# EAGLE design powerled (EAGLE 6.4)
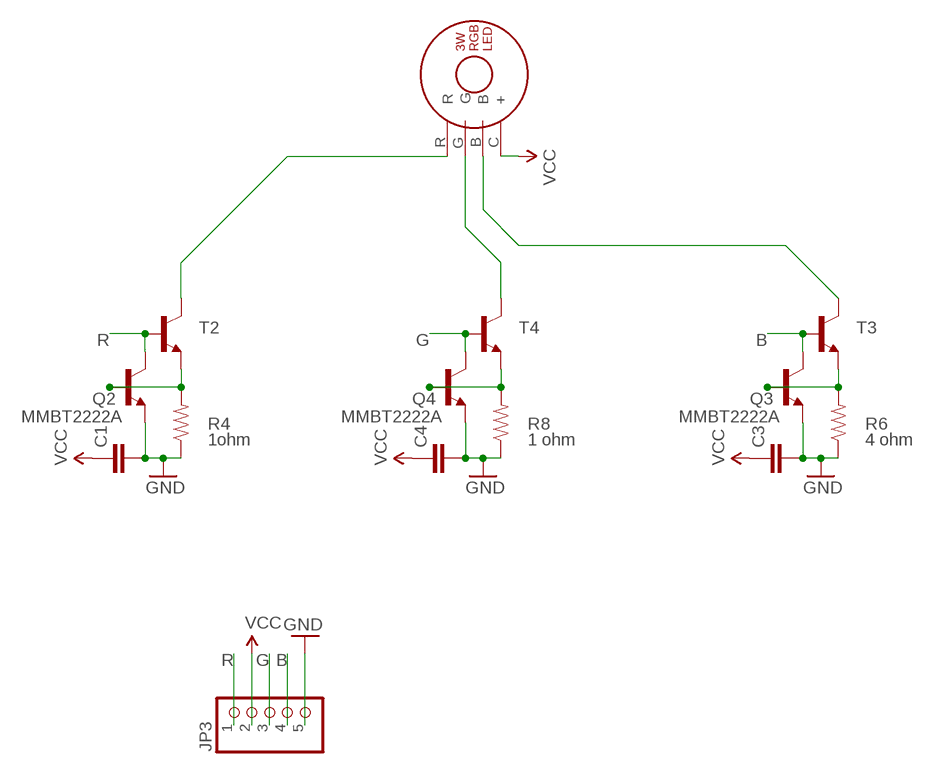
[diagram p0: schematic, sheet 1]

## Parts
C1  SPARKFUN_CAP0603-CAP  [SPARKFUN_0603-CAP]
C3  SPARKFUN_CAP0603-CAP  [SPARKFUN_0603-CAP]
C4  SPARKFUN_CAP0603-CAP  [SPARKFUN_0603-CAP]
JP3  PINHD-1X5  [1X05]
Q2  MMBT2222A  TRANSISTOR_NPNMMBT2222A  [SOT23-3]
Q3  MMBT2222A  TRANSISTOR_NPNMMBT2222A  [SOT23-3]
Q4  MMBT2222A  TRANSISTOR_NPNMMBT2222A  [SOT23-3]
R4  1ohm  RESISTOR0603-RES  [0603-RES]
R6  4 ohm  RESISTOR0603-RES  [0603-RES]
R8  1 ohm  RESISTOR0603-RES  [0603-RES]
T2  BCX54-NPN-SOT89-BCE  [SOT89-BCE]
T3  BCX54-NPN-SOT89-BCE  [SOT89-BCE]
T4  BCX54-NPN-SOT89-BCE  [SOT89-BCE]
U$1  RGB3W  [RGB3W]

## Nets
B: JP3.4 Q3.3(C) T3.B
G: JP3.3 Q4.3(C) T4.B
GND: C1.2 C3.2 C4.2 JP3.5 Q2.2(E) Q3.2(E) Q4.2(E) R4.1 R6.1 R8.1
N$1: T2.C U$1.R
N$2: T4.C U$1.G
N$3: T3.C U$1.B
N$8: Q2.1(B) R4.2 T2.E
N$11: Q3.1(B) R6.2 T3.E
N$13: Q4.1(B) R8.2 T4.E
R: JP3.1 Q2.3(C) T2.B
VCC: C1.1 C3.1 C4.1 JP3.2 U$1.C(+)

## Library data of the parts
C1 C3 C4 = MS3000_V1:SPARKFUN_CAP: Capacitor Standard 0603 ceramic capacitor, and 0.1" leaded capacitor.
JP3 = pinhead:PINHD-1X5: PIN HEADER
Q2-Q4 = SparkFun-DiscreteSemi:TRANSISTOR_NPN: Generic NPN BJT MMBT2222A - TRANS-08049 (SOT-23, 1A 40V) MPSA42 - TRANS-09116 (SOT-23, 500mA 300V) MMBT5088LT1G - TRANS-11160 (SOT-23, 50 mA 30V) BC547 - COM-08928 <http://www.sparkfun.com/products/8928> (TO-92 45V 100mA) (1.Collector 2.Base 3.Emitter) 2N3904 - COM-00521 <http://www.sparkfun.com/products/521> (TO-92 40V 200mA) (1.Emitter 2.Base 3.Collector) P2N2222A - COM-12852 <http://www.sparkfun.com/products/12852> (TO-92 40V 600mA) (1.Collector 2.Base 3.Emitter); PROD_ID: TRANS-08049
R4 R6 R8 = SparkFun-Passives:RESISTOR: Resistor Basic schematic elements and footprints for 0603, 1206, and PTH resistors.
T2-T4 = transistor:*-NPN-: NPN Transistror BF959 corrected 2008.03.06
U$1 = poerledlib:RGB3W

## Board
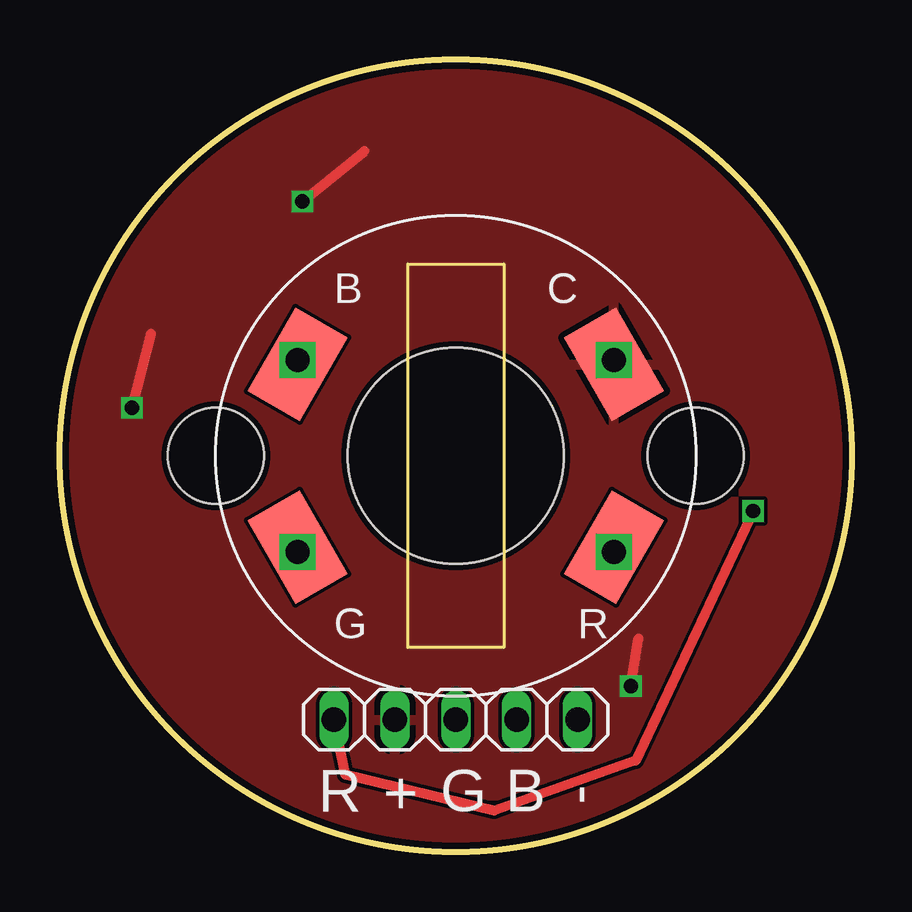
[diagram p1: board, top side]
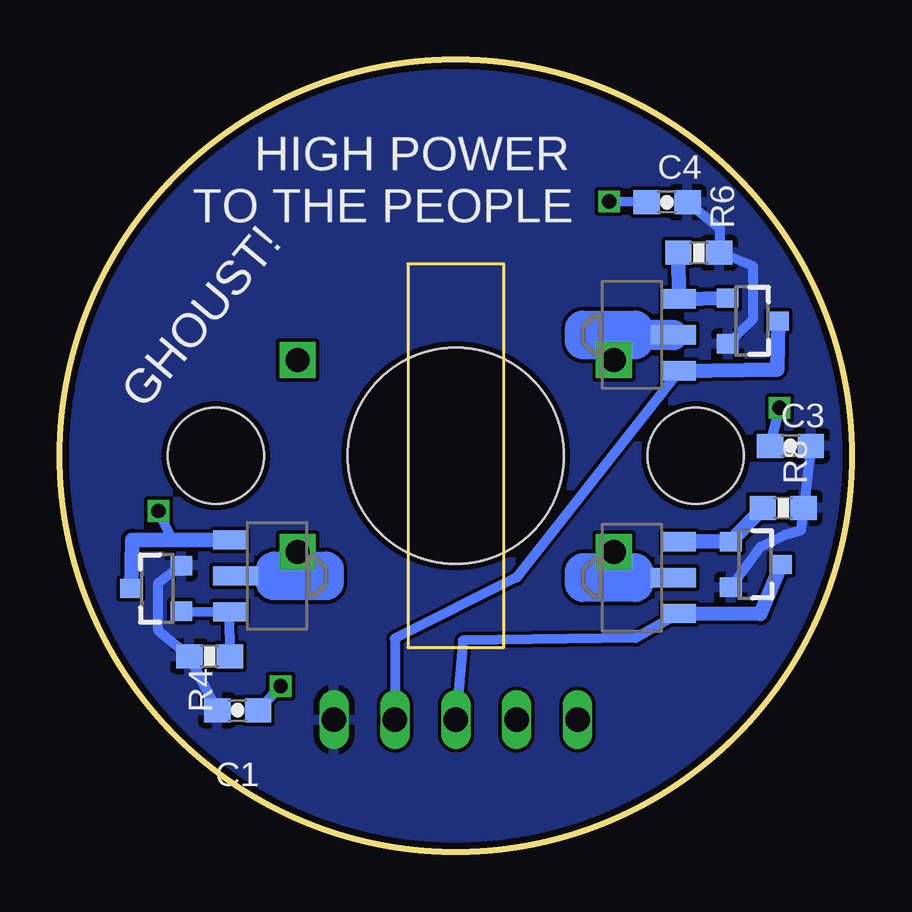
[diagram p2: board, bottom side, seen from below]

Size 33 x 33 mm. Coordinates in mm from the lower left corner, seen from the top.
Outline: circle at 16.5,16.5 radius 16.5
Copper layers (1*16): Top 0.035mm / dielectric 1.5mm / Bottom 0.035mm
Design rules "trippies *": minimum track width 6mil, minimum drill 12mil, track to track 6mil, track to pad 6mil, pad to pad 6mil, via to via 6mil, smd to smd 0mil, copper to edge 10mil, drill to drill 10mil, minimum pad ring 1mil, minimum via ring 6mil, stop-mask expansion 0mil, vias tented up to drill 100mil, thermal gap 10mil

### Footprints (pad centres in the part's own frame; a part is rotated, then mirrored left to right if it is on the bottom)
SPARKFUN_0603-CAP = smd 1.1 x 1: 1 -0.85,0; 2 0.85,0
1X05 = drill 1.016 long: 1 -5.08,0; 2 -2.54,0; 3 0,0; 4 2.54,0; 5 5.08,0
SOT23-3 = smd 0.8 x 0.9: 1 -0.95,-1; 2 0.95,-1; 3 0,1.1
0603-RES = smd 1.1 x 1: 1 -0.85,0; 2 0.85,0
SOT89-BCE = smd 0.8 x 1.4: B -1.499,-1.981; E 1.499,-1.981 | smd 0.8 x 1.9: C 0,-1.727
RGB3W = smd 4 x 2.5 rotated 60: B -6.599,3.81; R 6.599,-3.81 | smd 4 x 2.5 rotated 120: C 6.599,3.81; G -6.599,-3.81 | hole 4: 10,0; -10,0 | hole 9: 0,0

### Placement (x,y rotation side)
C1  25.59,5.89 180 bottom
C3  2.55,16.91 0 bottom
C4  7.69,27.07 0 bottom
JP3  16.5,5.5 0 top
Q2  28.94,10.97 90 bottom
Q3  4.16,22.12 270 bottom
Q4  4.03,11.97 270 bottom
R4  26.76,8.14 0 bottom
R6  6.37,24.96 180 bottom
R8  2.85,14.33 180 bottom
T2  23.94,11.49 270 bottom
T3  9.17,21.54 90 bottom
T4  9.17,11.42 90 bottom
U$1  16.5,16.5 0 top

### Tracks (layer width: path | path; a pad name or v marks a point on that pad's centre or on a via)
B
  Bottom 0.406: T3.B 13.96,11.42 19.04,8.88 JP3.4
  Bottom 0.61: Q3.3 3.1,20.1 T3.B
G
  Bottom 0.406: T4.B 9,8.9 16.2,8.8 JP3.3
  Bottom 0.61: Q4.3 3.8,9.9 T4.B
GND
  Bottom 0.406: C4.2 5.5,26 R6.1 4.1,24.4 4.1,22.2 Q3.2 | Q2.2 28.9,11.2 28.9,9.2 R4.1 C1.2 | Q4.2 3.8,12.7 2.8,13.2 2.1,13.4 R8.1 C3.2
  pour Bottom: -0.01,33.01 33.01,33.01 33.01,-0.01 -0.01,-0.01
N$1  (via drill 1)
  Top 1.27: U$1.R v23.1,12.5
  Bottom 0.406: T2.C 22.85,11.42
  Bottom 1.27: v23.1,12.5 22.85,11.42
N$2  (via drill 1)
  Top 1.27: v9.9,12.5 10.15,11.42 U$1.G
  Bottom 0.406: T4.C 10.15,11.42
  Bottom 1.27: 10.15,11.42 v9.9,12.5
N$3  (via drill 1)
  Top 1.27: U$1.B v9.9,20.5
  Bottom 1.27: v9.9,20.5 10.15,21.58 T3.C
N$8
  Bottom 0.406: Q2.1 T2.E R4.2
N$11
  Bottom 0.61: R6.2 T3.E Q3.1
N$13
  Bottom 0.61: T4.E Q4.1 R8.2
R  (via drill 0.6)
  Top 0.406: v28.9,14.2 24,3.8 18.1,1.7 11.9,3.2 JP3.1
  Bottom 0.406: T2.B 28.3,13 v28.9,14.2
  Bottom 0.61: Q2.3 30,13 T2.B
VCC  (via drill 0.6, 1)
  Top 0.406: v10.1,27.1 12.69,29.2 | v23.8,6.9 24.12,8.88 | v3,18.5 3.8,21.58
  Bottom 0.406: C4.1 v10.1,27.1 | C1.1 v23.8,6.9 | C3.1 v3,18.5
  other vias: 23.1,20.5
  pour Top: -0.01,33.01 33.01,33.01 33.01,-0.01 -0.01,-0.01

### Text on the board
tPlace: R | + | G | B | -
bPlace: HIGH POWER | TO THE PEOPLE | GHOUST!